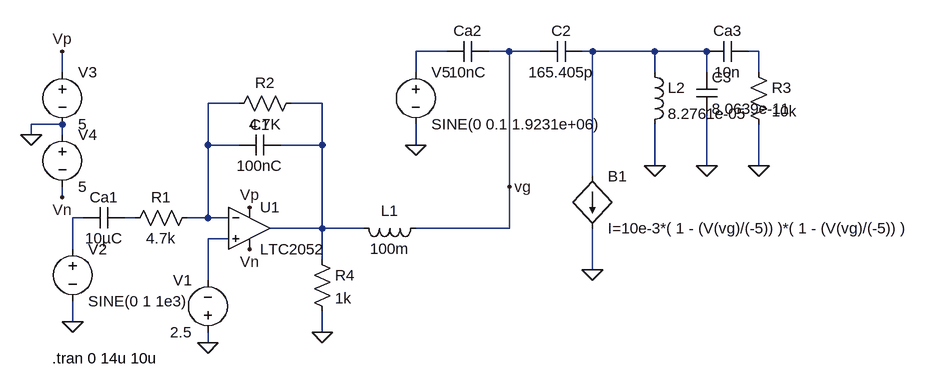
[diagram p0: schematic armstrong.asc]
armstrong.asc, the LTspice schematic file:
Version 4
SHEET 1 1244 680
WIRE 432 -32 384 -32
WIRE 528 -32 496 -32
WIRE 576 -32 528 -32
WIRE 656 -32 640 -32
WIRE 752 -32 656 -32
WIRE 832 -32 752 -32
WIRE 912 -32 896 -32
WIRE -160 0 -160 -32
WIRE 384 0 384 -32
WIRE 752 0 752 -32
WIRE 832 0 832 -32
WIRE 912 0 912 -32
WIRE 112 48 64 48
WIRE 240 48 192 48
WIRE -160 80 -208 80
WIRE -208 96 -208 80
WIRE -160 96 -160 80
WIRE 64 112 64 48
WIRE 112 112 64 112
WIRE 240 112 240 48
WIRE 240 112 176 112
WIRE 384 112 384 80
WIRE 752 144 752 80
WIRE 832 144 832 64
WIRE 912 144 912 80
WIRE 656 160 656 -32
WIRE 528 176 528 -32
WIRE -160 192 -160 176
WIRE -128 224 -144 224
WIRE -48 224 -64 224
WIRE 64 224 64 112
WIRE 64 224 32 224
WIRE 96 224 64 224
WIRE 240 240 240 112
WIRE 240 240 160 240
WIRE 304 240 240 240
WIRE 528 240 528 176
WIRE 528 240 384 240
WIRE 96 256 64 256
WIRE -144 272 -144 224
WIRE 240 288 240 240
WIRE 656 304 656 240
WIRE 64 320 64 256
WIRE -144 384 -144 352
WIRE 240 400 240 368
WIRE 64 416 64 400
FLAG 64 416 0
FLAG -144 384 0
FLAG -208 96 0
FLAG -160 -32 Vp
FLAG 128 208 Vp
FLAG -160 192 Vn
FLAG 128 272 Vn
FLAG 384 112 0
FLAG 656 304 0
FLAG 528 176 vg
FLAG 752 144 0
FLAG 832 144 0
FLAG 912 144 0
FLAG 240 400 0
SYMBOL res 48 208 R90
WINDOW 0 0 56 VBottom 2
WINDOW 3 32 56 VTop 2
SYMATTR InstName R1
SYMATTR Value 4.7k
SYMBOL res 208 32 R90
WINDOW 0 0 56 VBottom 2
WINDOW 3 32 56 VTop 2
SYMATTR InstName R2
SYMATTR Value 4.7K
SYMBOL cap 176 96 R90
WINDOW 0 0 32 VBottom 2
WINDOW 3 32 32 VTop 2
SYMATTR InstName C1
SYMATTR Value 100nC
SYMBOL cap -64 208 R90
WINDOW 0 0 32 VBottom 2
WINDOW 3 32 32 VTop 2
SYMATTR InstName Ca1
SYMATTR Value 10µC
SYMBOL voltage 64 416 R180
WINDOW 0 24 96 Left 2
WINDOW 3 24 16 Left 2
WINDOW 123 0 0 Left 2
WINDOW 39 0 0 Left 2
SYMATTR InstName V1
SYMATTR Value 2.5
SYMBOL voltage -144 256 R0
WINDOW 123 0 0 Left 2
WINDOW 39 0 0 Left 2
SYMATTR InstName V2
SYMATTR Value SINE(0 1 1e3)
SYMBOL Opamps\\LTC2052 128 240 R0
SYMATTR InstName U1
SYMBOL voltage -160 -16 R0
WINDOW 123 0 0 Left 2
WINDOW 39 0 0 Left 2
SYMATTR InstName V3
SYMATTR Value 5
SYMBOL voltage -160 80 R0
WINDOW 123 0 0 Left 2
WINDOW 39 0 0 Left 2
SYMATTR InstName V4
SYMATTR Value 5
SYMBOL ind 400 224 R90
WINDOW 0 5 56 VBottom 2
WINDOW 3 32 56 VTop 2
SYMATTR InstName L1
SYMATTR Value 100m
SYMBOL voltage 384 -16 R0
WINDOW 123 0 0 Left 2
WINDOW 39 0 0 Left 2
SYMATTR InstName V5
SYMATTR Value SINE(0 0.1 1.9231e+06)
SYMBOL cap 496 -48 R90
WINDOW 0 0 32 VBottom 2
WINDOW 3 32 32 VTop 2
SYMATTR InstName Ca2
SYMATTR Value 10nC
SYMBOL cap 640 -48 R90
WINDOW 0 0 32 VBottom 2
WINDOW 3 32 32 VTop 2
SYMATTR InstName C2
SYMATTR Value 165.405p
SYMBOL bi 656 160 R0
SYMATTR InstName B1
SYMATTR Value I=10e-3*( 1 - (V(vg)/(-5)) )*( 1 - (V(vg)/(-5)) )
SYMBOL ind 736 -16 R0
SYMATTR InstName L2
SYMATTR Value 8.2761e-05
SYMBOL cap 816 0 R0
SYMATTR InstName C3
SYMATTR Value 8.0639e-11
SYMBOL res 896 -16 R0
SYMATTR InstName R3
SYMATTR Value 10k
SYMBOL cap 896 -48 R90
WINDOW 0 0 32 VBottom 2
WINDOW 3 32 32 VTop 2
SYMATTR InstName Ca3
SYMATTR Value 10n
SYMBOL res 224 272 R0
SYMATTR InstName R4
SYMATTR Value 1k
TEXT -176 440 Left 2 !.tran 0 14u 10u

The netlist it stands for:
* armstrong.asc
R1 N004 N007 4.7k
R2 N005 N004 4.7K
C1 N005 N004 100nC
Ca1 N007 N006 10µC
V1 0 N008 2.5
V2 N006 0 SINE(0 1 1e3)
* U1: LTC2052 (symbol Opamps\LTC2052 not available, pins judged from their places): In+=N008 In-=N004 V+=Vp V-=Vn OUT=N005
V3 Vp 0 5
V4 0 Vn 5
L1 vg N005 100m
V5 N001 0 SINE(0 0.1 1.9231e+06)
Ca2 vg N001 10nC
C2 N002 vg 165.405p
B1 N002 0 I=10e-3*( 1 - (V(vg)/(-5)) )*( 1 - (V(vg)/(-5)) )
L2 N002 0 8.2761e-05
C3 N002 0 8.0639e-11
R3 N003 0 10k
Ca3 N003 N002 10n
R4 N005 0 1k
.tran 0 14u 10u
.backanno
.end